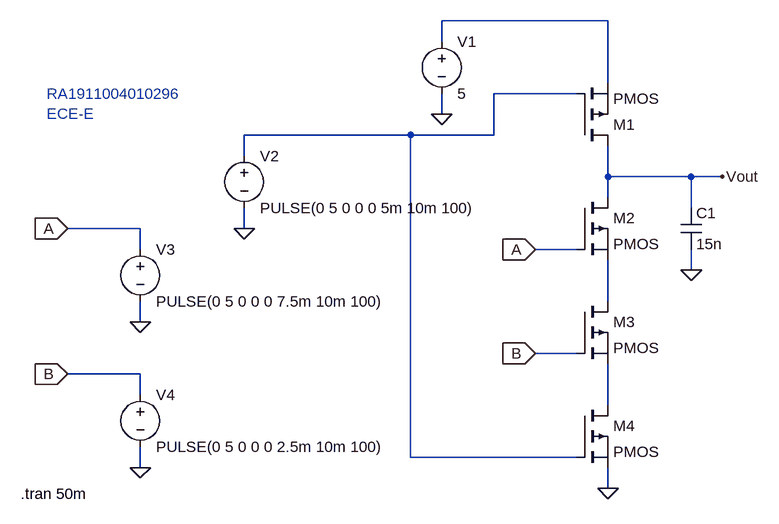
[diagram p0: schematic expt-12.asc]
expt-12.asc, the LTspice schematic file:
Version 4
SHEET 1 1088 968
WIRE 352 128 96 128
WIRE 96 160 96 128
WIRE 352 224 352 128
WIRE 304 240 176 240
WIRE 96 272 96 240
WIRE 48 304 -208 304
WIRE 176 304 176 240
WIRE 176 304 48 304
WIRE -208 336 -208 304
WIRE 352 368 352 320
WIRE 480 368 352 368
WIRE 528 368 480 368
WIRE 352 400 352 368
WIRE 480 416 480 368
WIRE -368 448 -480 448
WIRE -208 448 -208 416
WIRE -368 480 -368 448
WIRE 304 480 240 480
WIRE 480 512 480 480
WIRE 352 560 352 496
WIRE -368 592 -368 560
WIRE 304 640 240 640
WIRE -368 672 -480 672
WIRE -368 704 -368 672
WIRE 352 720 352 656
WIRE 48 800 48 304
WIRE 304 800 48 800
WIRE -368 816 -368 784
WIRE 352 848 352 816
FLAG 96 272 0
FLAG -208 448 0
FLAG 352 848 0
FLAG 240 480 A
IOPIN 240 480 In
FLAG 240 640 B
IOPIN 240 640 In
FLAG -480 448 A
IOPIN -480 448 In
FLAG -480 672 B
IOPIN -480 672 In
FLAG -368 592 0
FLAG -368 816 0
FLAG 528 368 Vout
FLAG 480 512 0
SYMBOL voltage 96 144 R0
WINDOW 123 0 0 Left 0
WINDOW 39 0 0 Left 0
SYMATTR InstName V1
SYMATTR Value 5
SYMBOL voltage -208 320 R0
WINDOW 123 0 0 Left 0
WINDOW 39 0 0 Left 0
SYMATTR InstName V2
SYMATTR Value PULSE(0 5 0 0 0 5m 10m 100)
SYMBOL voltage -368 464 R0
WINDOW 123 0 0 Left 0
WINDOW 39 0 0 Left 0
SYMATTR InstName V3
SYMATTR Value PULSE(0 5 0 0 0 7.5m 10m 100)
SYMBOL voltage -368 688 R0
WINDOW 123 0 0 Left 0
WINDOW 39 0 0 Left 0
SYMATTR InstName V4
SYMATTR Value PULSE(0 5 0 0 0 2.5m 10m 100)
SYMBOL cap 464 416 R0
SYMATTR InstName C1
SYMATTR Value 15n
SYMBOL pmos 304 320 M180
SYMATTR InstName M1
SYMBOL pmos 304 400 R0
SYMATTR InstName M2
SYMBOL pmos 304 560 R0
SYMATTR InstName M3
SYMBOL pmos 304 720 R0
SYMATTR InstName M4
TEXT -552 856 Left 2 !.tran 50m
TEXT -512 240 Left 2 ;RA1911004010296\nECE-E

The netlist it stands for:
* expt-12.asc
V1 N001 0 5
V2 N002 0 PULSE(0 5 0 0 0 5m 10m 100)
V3 A 0 PULSE(0 5 0 0 0 7.5m 10m 100)
V4 B 0 PULSE(0 5 0 0 0 2.5m 10m 100)
C1 Vout 0 15n
M1 Vout N002 N001 N001 PMOS
M2 Vout A N003 N003 PMOS
M3 N003 B N004 N004 PMOS
M4 N004 N002 0 0 PMOS
.model NMOS NMOS
.model PMOS PMOS
.lib standard.mos
.tran 50m
* RA1911004010296
* ECE-E
.backanno
.end